# Altium schematic sheet Connectors.SchDoc
size A; DocumentNumber: 4; SheetNumber: 4; SheetTotal: 4
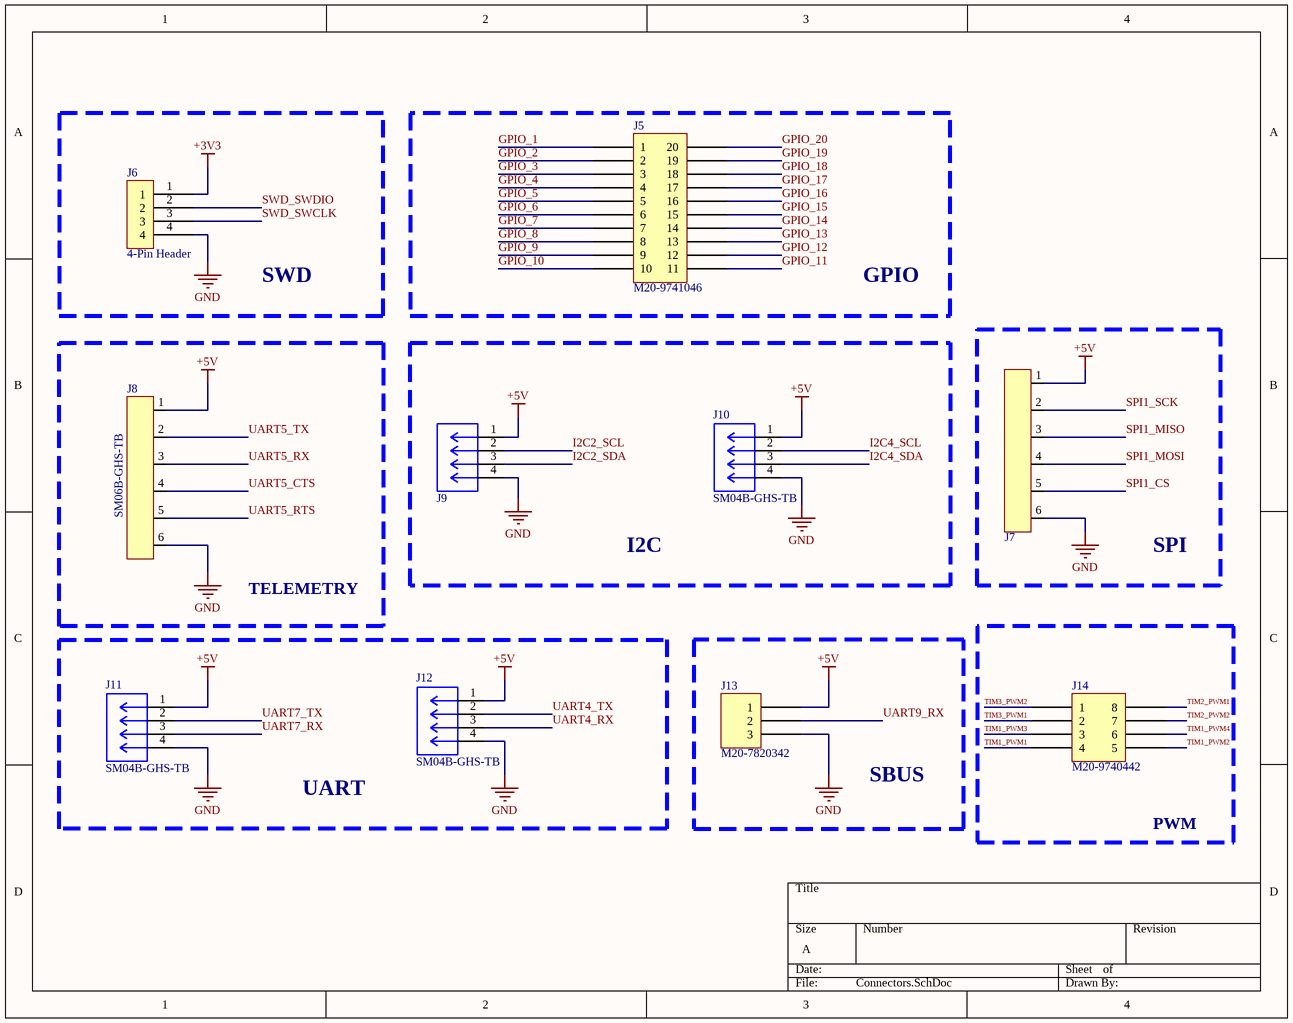
[diagram p0: Connectors.SchDoc]

## Parts
J5  M20-9741046  [HARWIN M20-9741045]
J6  4-Pin Header  [4-Pin Header]
J7  SM06B-GHS-TB  [SM06B-GHS-TB]  (value not drawn)
J8  SM06B-GHS-TB  [SM06B-GHS-TB]
J9  SM04B-GHS-TB  [CONN_SM04B-GHS-TB_JST]  (value not drawn)
J10  SM04B-GHS-TB  [CONN_SM04B-GHS-TB_JST]
J11  SM04B-GHS-TB  [CONN_SM04B-GHS-TB_JST]
J12  SM04B-GHS-TB  [CONN_SM04B-GHS-TB_JST]
J13  M20-7820342  [HARWIN M20-7820345]
J14  M20-9740442  [HARWIN M20-9740445]

## Blocks framed on the sheet
SWD: J6
GPIO: J5
SPI: J7
TELEMETRY: J8
I2C: J9 J10
UART: J11 J12
SBUS: J13
PWM: J14

## Nets
+3V3: J6.1
+5V: J7.1 J8.1 J9.1 J10.1 J11.1 J12.1 J13.1
GND: J6.4 J7.6 J8.6 J9.4 J10.4 J11.4 J12.4 J13.3
GPIO_1: J5.1
GPIO_2: J5.2
GPIO_3: J5.3
GPIO_4: J5.4
GPIO_5: J5.5
GPIO_6: J5.6
GPIO_7: J5.7
GPIO_8: J5.8
GPIO_9: J5.9
GPIO_10: J5.10
GPIO_11: J5.11
GPIO_12: J5.12
GPIO_13: J5.13
GPIO_14: J5.14
GPIO_15: J5.15
GPIO_16: J5.16
GPIO_17: J5.17
GPIO_18: J5.18
GPIO_19: J5.19
GPIO_20: J5.20
I2C2_SCL: J9.2
I2C2_SDA: J9.3
I2C4_SCL: J10.2
I2C4_SDA: J10.3
SPI1_CS: J7.5
SPI1_MISO: J7.3
SPI1_MOSI: J7.4
SPI1_SCK: J7.2
SWD_SWCLK: J6.3
SWD_SWDIO: J6.2
TIM1_PWM1: J14.4
TIM1_PWM2: J14.5
TIM1_PWM3: J14.3
TIM1_PWM4: J14.6
TIM2_PWM1: J14.8
TIM2_PWM2: J14.7
TIM3_PWM1: J14.2
TIM3_PWM2: J14.1
UART4_RX: J12.3
UART4_TX: J12.2
UART5_CTS: J8.4
UART5_RTS: J8.5
UART5_RX: J8.3
UART5_TX: J8.2
UART7_RX: J11.3
UART7_TX: J11.2
UART9_RX: J13.2

## Library data of the parts
J5 = M20-9741046: CONN HEADER R/A 20POS 2.54MM; Manufacturer: Harwin Inc.; Connector Type: Header, Cuttable; Current Rating (Amps): 3A per Contact; Material Flammability Rating: UL94 V-0; Number of Positions: 20; Number of Positions Loaded: All; Shrouding: Unshrouded; Style: Board to Board or Cable; Part Number: M20-9741046; ComponentLink1Description: Datasheet; ComponentLink1URL: https://cdn.harwin.com/pdfs/M20-974.pdf; ComponentLink2Description: DigiKey Link; ComponentLink2URL: http://digikey.com/product-detail/en/harwin-inc/M20-9741046/M20-9741046-ND/3920727; Contact Finish - Mating: Tin; Contact Finish - Post: Tin; Contact Material: Brass; Contact Shape: Square; Contact Type: Male Pin; Fastening Type: Push-Pull; Insulation Color: Black; Insulation Material: Polyamide (PA6T), Nylon 6T; LastUpdated: 21.09.2022 19:20:06; Lifecycle Status: Active; Minimum Order: 1200; Mounting Type: Through Hole, Right Angle; Number of Rows: 2; Operating Temperature: -40°C ~ 105°C; Packaging: Bulk; PartId: 162; Part Status: Active; Price: 0.31; Series: M20; Supplier 1: DigiKey; Supplier Part Number 1: M20-9741046-ND; Termination: Solder
J7 J8 = SM06B-GHS-TB: Header Connector 6 Position 1.25MM Pitch SMD Horizontal JST GH; Manufacturer: JST; Manufacturer Part Number: SM06B-GHS-TB
J9-J12 = SM04B-GHS-TB: Connector Header Surface Mount, Right Angle 4 position 0.049 (1.25mm); MF: JST Sales; SnapEDA_Link: https://www.snapeda.com/parts/SM04B-GHS-TB/JST/view-part/?ref=snap; Package: None; Value: *; MP: SM04B-GHS-TB; Check_prices: https://www.snapeda.com/parts/SM04B-GHS-TB/JST/view-part/?ref=eda
J13 = M20-7820342: CONN RCPT 3POS 0.1 GOLD PCB; Manufacturer: Harwin Inc.; Connector Type: Receptacle; Contact Length - Post: 0.118" (3.00mm); Current Rating (Amps): 3A; Mated Stacking Heights: 11.04mm, 12.63mm; Material Flammability Rating: UL94 V-0; Number of Positions: 3; Number of Positions Loaded: All; Pitch - Mating: 0.100" (2.54mm); Style: Board to Board or Cable; Part Number: M20-7820342; ComponentLink1Description: Datasheet; ComponentLink1URL: https://cdn.harwin.com/pdfs/Harwin_PC_Connectors_M20.pdf; ComponentLink2Description: DigiKey Link; ComponentLink2URL: https://www.digikey.com/en/products/detail/harwin-inc/M20-7820342/3727752; Contact Finish - Mating: Gold; Contact Finish - Post: Tin; Contact Finish Thickness - Mating: Flash; Contact Type: Female Socket; Fastening Type: Push-Pull; Insulation Color: Black; Insulation Height: 0.335" (8.51mm); LastUpdated: 21.09.2022 18:55:13; Lifecycle Status: Active; Minimum Order: 1; Mounting Type: Through Hole; Number of Rows: 1; Operating Temperature: -40°C ~ 105°C; Packaging: Tube; Part Status: Active; Price: 0.42; Series: M20; Supplier 1: DigiKey; Supplier Part Number 1: 952-1783-ND; Termination: Solder
J14 = M20-9740442: CONN HEADER R/A 8POS 2.54MM; Manufacturer: Harwin Inc.; Connector Type: Header, Cuttable; Current Rating (Amps): 3A per Contact; Material Flammability Rating: UL94 V-0; Number of Positions: 8; Number of Positions Loaded: All; Shrouding: Unshrouded; Style: Board to Board or Cable; Part Number: M20-9740442; ComponentLink1Description: Datasheet; ComponentLink1URL: https://cdn.harwin.com/pdfs/M20-974.pdf; ComponentLink2Description: DigiKey Link; ComponentLink2URL: http://digikey.com/product-detail/en/harwin-inc/M20-9740442/M20-9740442-ND/3920714; Contact Finish - Mating: Gold; Contact Finish - Post: Tin; Contact Material: Brass; Contact Shape: Square; Contact Type: Male Pin; Fastening Type: Push-Pull; Insulation Color: Black; Insulation Material: Polyamide (PA6T), Nylon 6T; LastUpdated: 21.09.2022 19:17:53; Lifecycle Status: Active; Minimum Order: 5000; Mounting Type: Through Hole, Right Angle; Number of Rows: 2; Operating Temperature: -40°C ~ 105°C; Packaging: Bulk; PartId: 157; Part Status: Active; Price: 0.18; Series: M20; Supplier 1: DigiKey; Supplier Part Number 1: M20-9740442-ND; Termination: Solder